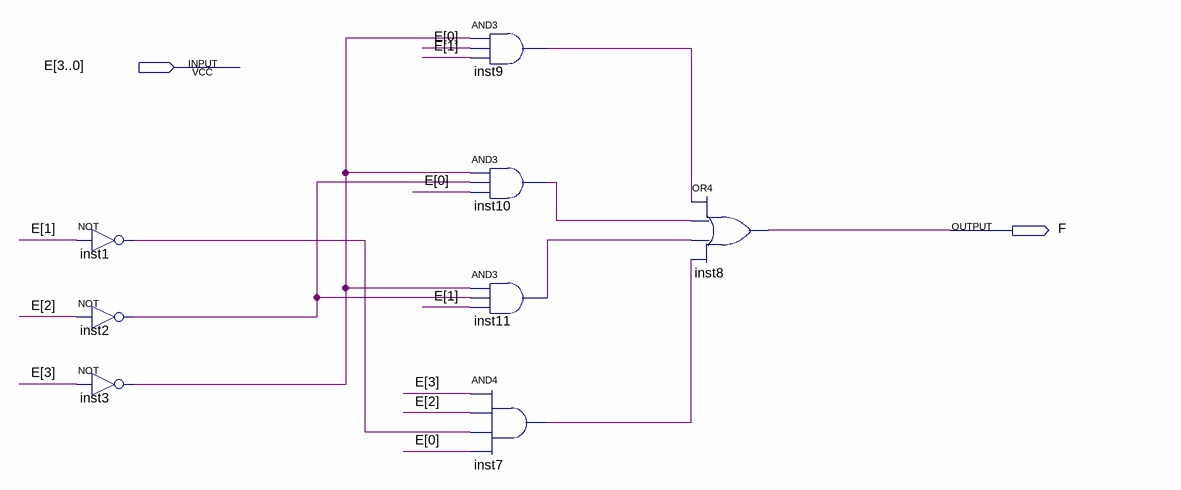
[diagram p0: schematic sheet]
// Quartus schematic displayF.bdf as structural Verilog: 8 symbols, 2 pins
module displayF (
  input  [3:0] E,
  output F
);

  wire inst1_out, inst2_out, inst3_out, inst7_out, inst9_out, inst10_out, inst11_out;

  not inst1 (inst1_out, E[1]);
  not inst2 (inst2_out, E[2]);
  not inst3 (inst3_out, E[3]);
  and inst9 (inst9_out, inst3_out, E[0], E[1]);
  and inst10 (inst10_out, inst3_out, inst2_out, E[0]);
  and inst11 (inst11_out, inst3_out, inst2_out, E[1]);
  and inst7 (inst7_out, E[3], E[2], inst1_out, E[0]);
  or inst8 (F, inst9_out, inst10_out, inst11_out, inst7_out);
endmodule
